# EasyEDA Pro project G-CU ver 2.3.C.eprj, schematic Schematic2
Create Date: 2024-10-28; Page Name: P1; Project Name: G-CU ver 2.2.C; Schematic Name: Schematic2; Update Date: 2024-10-28; Company: 嘉立创EDA; Page Size: A4; Version: V1.0
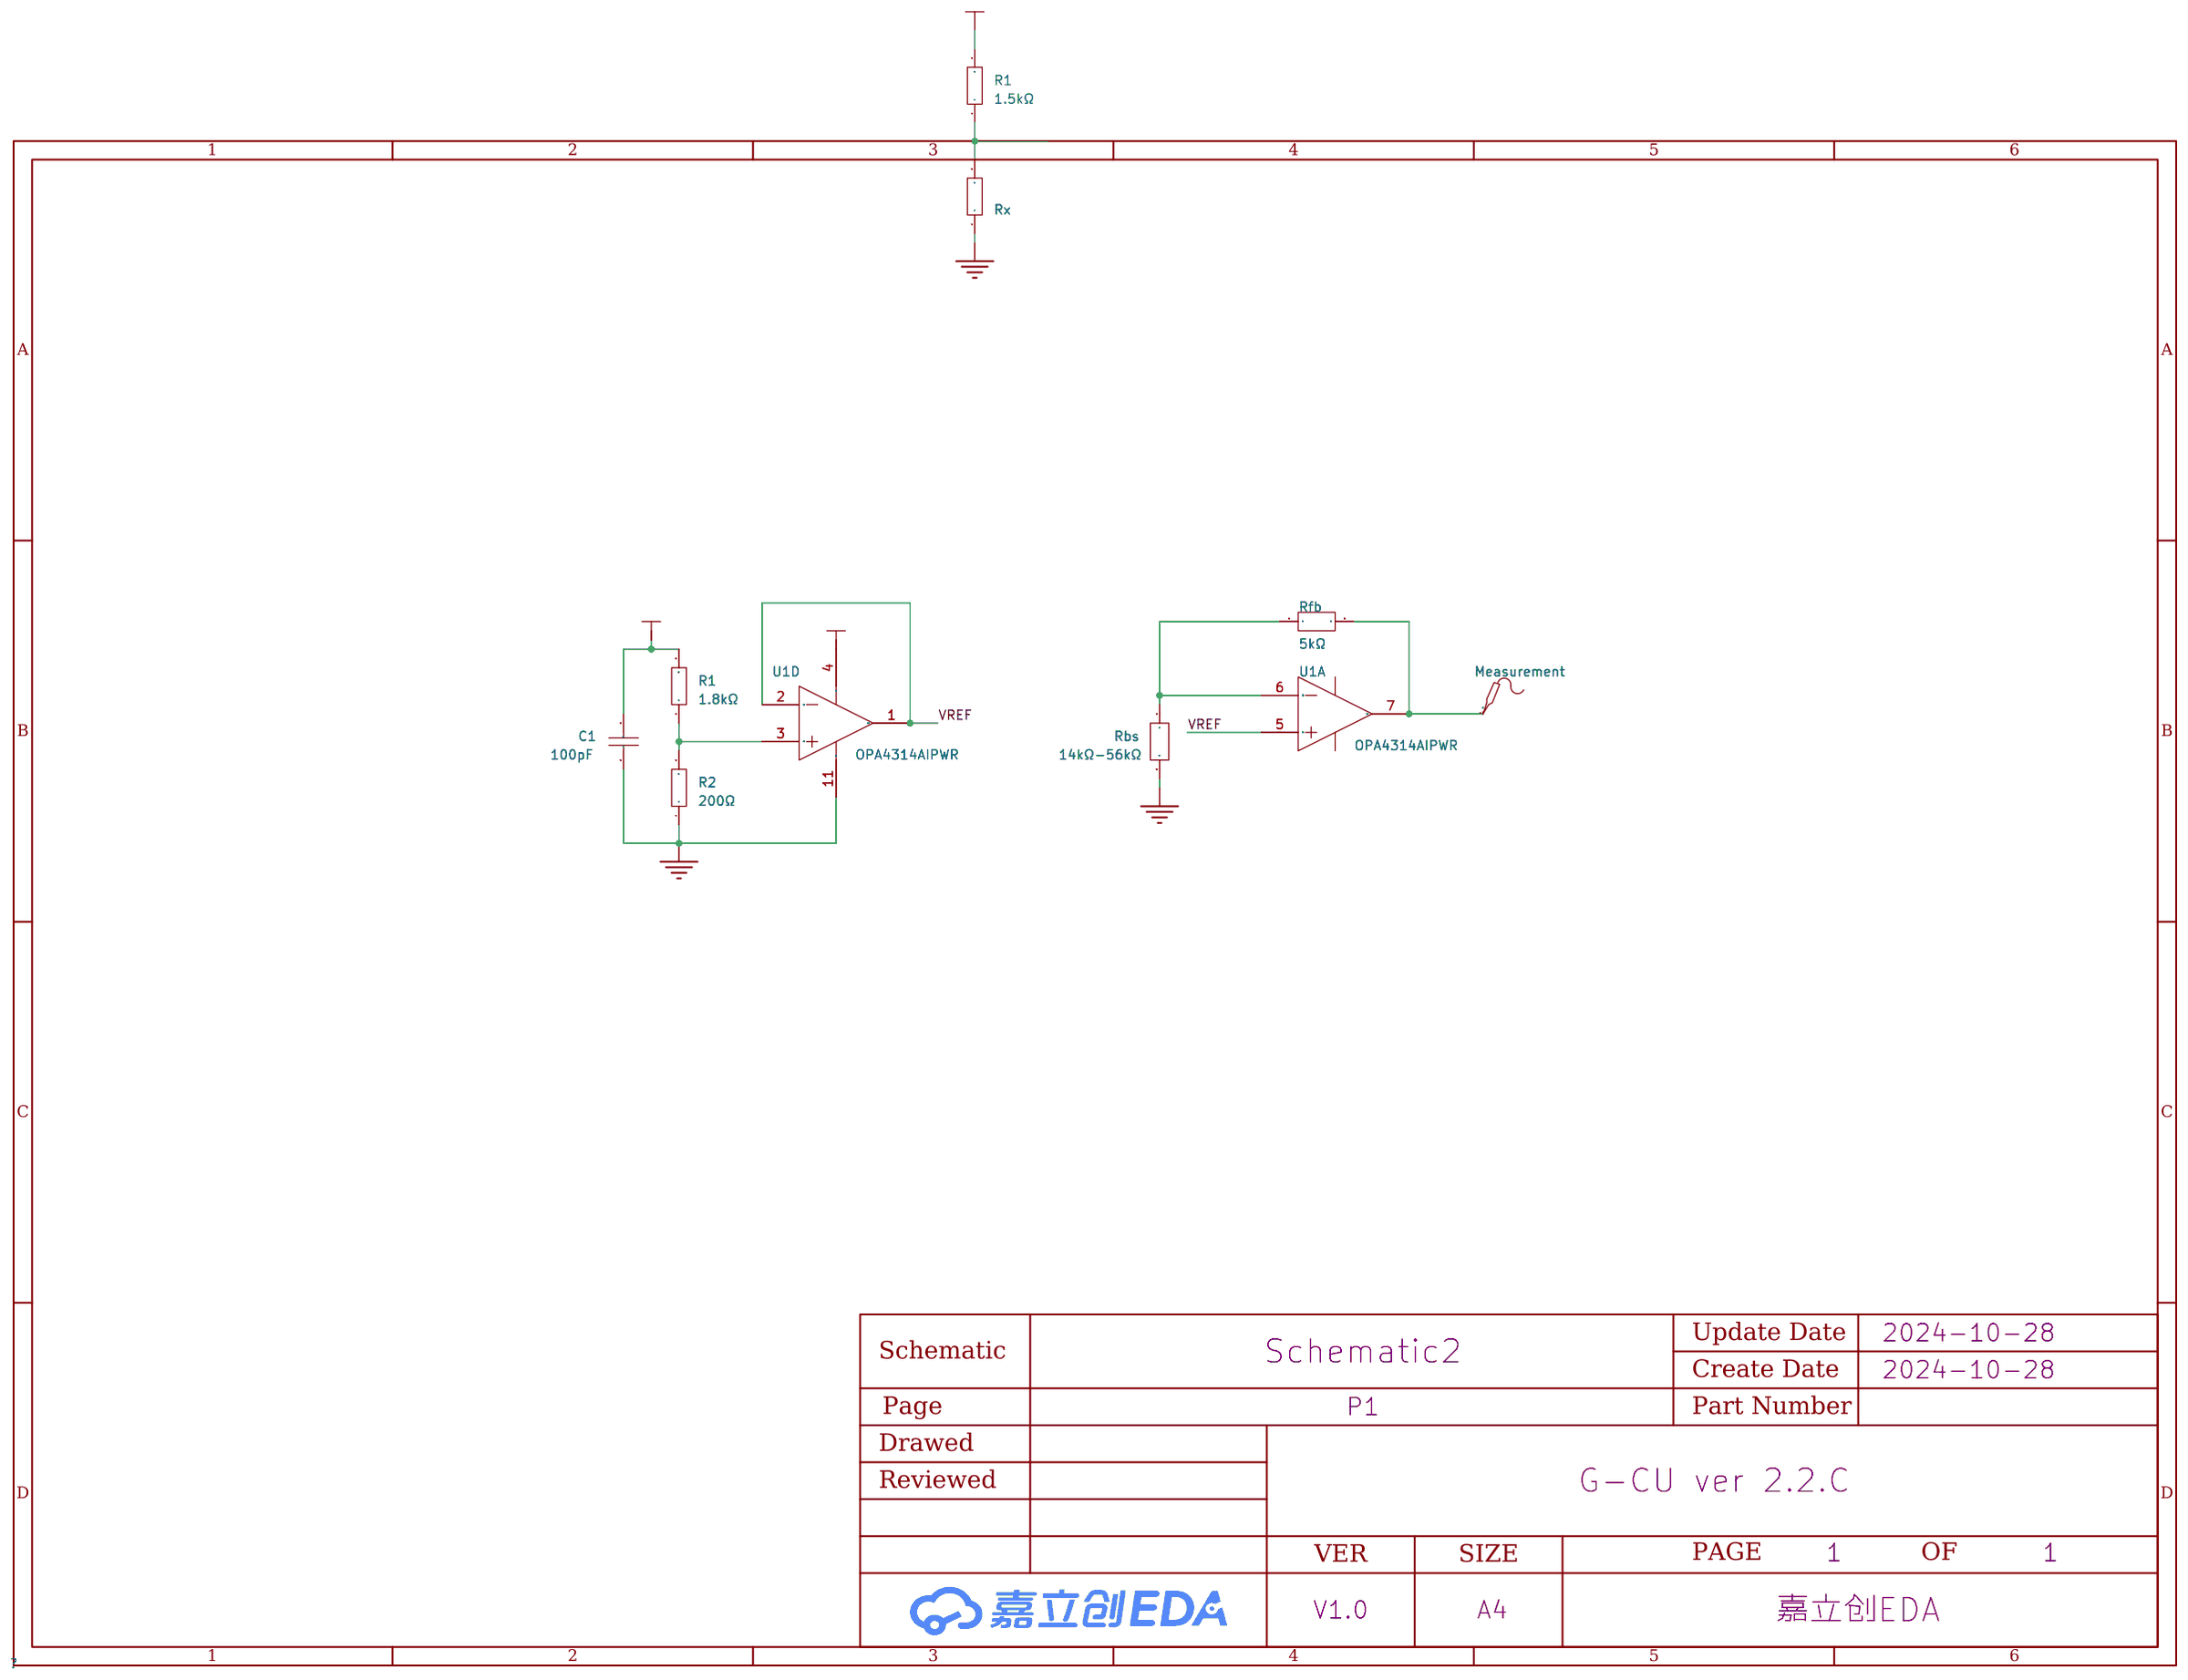
[diagram p1: schematic sheet]

## Parts
C1  100pF  [C0402]
Measurement  -  [Test-Point-0.5mm]
R1  1.8kΩ  [R0402]
R1#2  1.5kΩ  [R0402]
R2  200Ω  [R0402]
Rbs  14kΩ-56kΩ  [R0603]
Rfb  5kΩ  [R0603]
Rx  200Ω  [R0402]
U1  OPA4314AIPWR  [TSSOP-14_L5.0-W4.4-P0.65-LS6.4-BL]  (sections 1,4)

## Library data of the parts
C1 = 0402CG101J500NT: 容值:100pF;精度:±5%;额定电压:50V;材质(温度系数):C0G;; LCSC Part Name: 100pF ±5% 50V; Supplier Part: C1546; Manufacturer: FH(风华); Supplier Footprint: 0402; JLCPCB Part Class: Basic Part; Datasheet: https://atta.szlcsc.com/upload/public/pdf/source/20170923/C1546_1506149265265988353.pdf; Supplier: LCSC; Tolerance: ±5%; Voltage Rated: 50V; Temperature Coefficient: C0G
Measurement = Test-Point: Test Point 测试点
R1 R1#2 = 0402WGF1801TCE: 电阻类型:厚膜电阻;阻值:1.8kΩ;精度:±1%;功率:62.5mW;; LCSC Part Name: 1.8kΩ ±1% 62.5mW; Supplier Part: C25871; Manufacturer: UNI-ROYAL(厚声); Supplier Footprint: 0402; JLCPCB Part Class: Extended Part; Datasheet: https://atta.szlcsc.com/upload/public/pdf/source/20200306/C422600_1E6D84923E4A46A82E41ADD87F860B5C.pdf; Supplier: LCSC; Type: 厚膜电阻; Tolerance: ±1%; Power(Watts): 62.5mW; Temperature Coefficient: ±100ppm/℃; Overload Voltage (Max): 50V; Operating Temperature Range: -55℃~+155℃
R2 Rx = 0402WGF2000TCE: 电阻类型:厚膜电阻;阻值:200Ω;精度:±1%;功率:62.5mW;; LCSC Part Name: 200Ω ±1% 62.5mW; Supplier Part: C25087; Manufacturer: UNI-ROYAL(厚声); Supplier Footprint: 0402; JLCPCB Part Class: Basic Part; Datasheet: https://atta.szlcsc.com/upload/public/pdf/source/20200306/C422600_1E6D84923E4A46A82E41ADD87F860B5C.pdf; Supplier: LCSC; Type: 厚膜电阻; Tolerance: ±1%; Power(Watts): 62.5mW; Temperature Coefficient: ±100ppm/℃; Overload Voltage (Max): 50V; Operating Temperature Range: -55℃~+155℃
Rbs Rfb = AR03BTCX5001: 电阻类型:薄膜电阻;阻值:5kΩ;精度:±0.1%;功率:100mW;; LCSC Part Name: 5kΩ ±0.1% 100mW; Supplier Part: C2828621; Manufacturer: Viking(光颉); Supplier Footprint: 0603; JLCPCB Part Class: Extended Part; Datasheet: https://atta.szlcsc.com/upload/public/pdf/source/20211009/C2828621_7F88408CB1D09DFC08036051E0A6050B.pdf; Supplier: LCSC; Type: 薄膜电阻; Tolerance: ±0.1%; Power(Watts): 100mW; Temperature Coefficient: ±25ppm/℃; Overload Voltage (Max): 50V; Operating Temperature Range: -55℃~+155℃
U1 = OPA4314AIPWR: OPA4314 四路、3MHz、低功耗、低噪声、RRI/O、1.8V CMOS 运算放大器; Supplier Part: C129333; Manufacturer: TI(德州仪器); Supplier Footprint: TSSOP-14; JLCPCB Part Class: Extended Part; Datasheet: https://atta.szlcsc.com/upload/public/pdf/source/20170914/C129333_1505359967979968173.pdf; Supplier: LCSC

## Nets
GND: C1.2 R2.1 Rbs.2 Rx.1 U1.11(V-)
Vdd: C1.1 R1.2 R1#2.2 U1.4(V+)
VREF: U1.1(OUT A) U1.2(IN A-) U1.5(IN B+)
Net-(Measurement-1): Measurement.1 Rfb.2 U1.7(OUT B)
Net-(R1#2-1): R1#2.1 Rx.2
Net-(R1-1): R1.1 R2.2 U1.3(IN A+)
Net-(Rbs-1): Rbs.1 Rfb.1 U1.6(IN B-)
